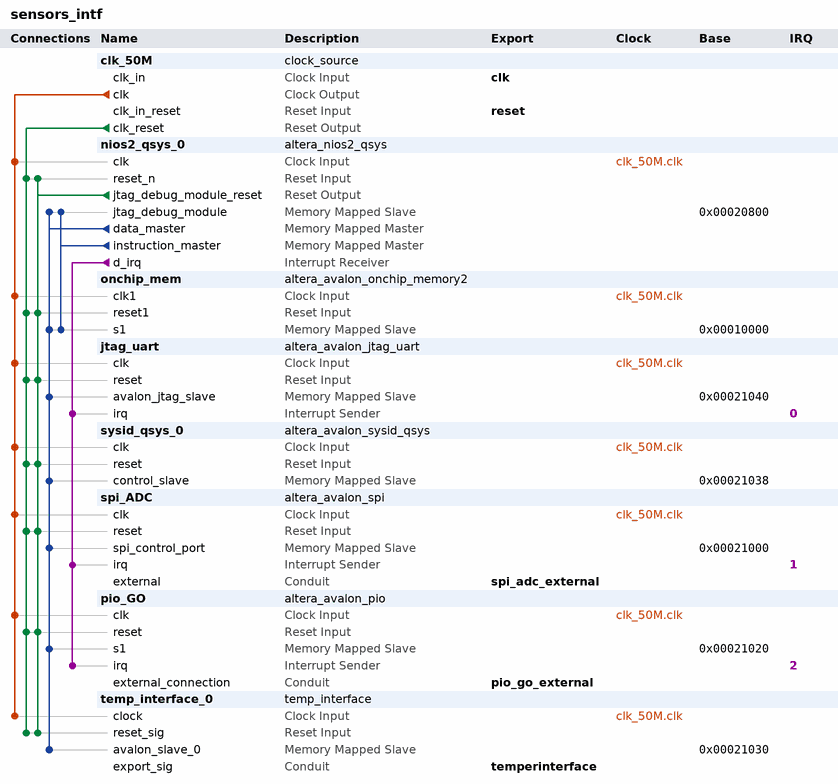
[diagram p0: system contents]
# Platform Designer (Qsys) system sensors_intf, Cyclone IV E EP4CE22F17C6
# Parameters at their usual value, and those the tool derives, are not listed.
package require -exact qsys 15.0
create_system sensors_intf
set_project_property DEVICE_FAMILY {Cyclone IV E}
set_project_property DEVICE EP4CE22F17C6

add_instance clk_50M clock_source 15.0
set_instance_parameter_value clk_50M clockFrequency 50000000

add_instance nios2_qsys_0 altera_nios2_qsys 15.0
set_instance_parameter_value nios2_qsys_0 breakSlave nios2_qsys_0.jtag_debug_module
set_instance_parameter_value nios2_qsys_0 exceptionSlave onchip_mem.s1
set_instance_parameter_value nios2_qsys_0 icache_size 8192
set_instance_parameter_value nios2_qsys_0 impl Small
set_instance_parameter_value nios2_qsys_0 mmu_TLBMissExcOffset 64
set_instance_parameter_value nios2_qsys_0 mmu_TLBMissExcSlave onchip_mem.s1
set_instance_parameter_value nios2_qsys_0 resetSlave onchip_mem.s1
set_instance_parameter_value nios2_qsys_0 resetrequest_enabled true

add_instance onchip_mem altera_avalon_onchip_memory2 15.0
set_instance_parameter_value onchip_mem dataWidth 32
set_instance_parameter_value onchip_mem dualPort false
set_instance_parameter_value onchip_mem initMemContent true
set_instance_parameter_value onchip_mem initializationFileName onchip_mem
set_instance_parameter_value onchip_mem memorySize 42000

add_instance jtag_uart altera_avalon_jtag_uart 15.0
set_instance_parameter_value jtag_uart simInteractiveOptions NO_INTERACTIVE_WINDOWS

add_instance sysid_qsys_0 altera_avalon_sysid_qsys 15.0
set_instance_parameter_value sysid_qsys_0 id 0

add_instance spi_ADC altera_avalon_spi 15.0
set_instance_parameter_value spi_ADC clockPhase 1
set_instance_parameter_value spi_ADC clockPolarity 1
set_instance_parameter_value spi_ADC dataWidth 16
set_instance_parameter_value spi_ADC masterSPI true
set_instance_parameter_value spi_ADC numberOfSlaves 1
set_instance_parameter_value spi_ADC targetClockRate 3200000

add_instance pio_GO altera_avalon_pio 15.0
set_instance_parameter_value pio_GO captureEdge true
set_instance_parameter_value pio_GO direction Input
set_instance_parameter_value pio_GO generateIRQ true
set_instance_parameter_value pio_GO irqType EDGE
set_instance_parameter_value pio_GO width 1

add_instance temp_interface_0 temp_interface 1.0

# connections
add_connection clk_50M.clk jtag_uart.clk clock
add_connection clk_50M.clk nios2_qsys_0.clk clock
add_connection clk_50M.clk onchip_mem.clk1 clock
add_connection clk_50M.clk pio_GO.clk clock
add_connection clk_50M.clk spi_ADC.clk clock
add_connection clk_50M.clk sysid_qsys_0.clk clock
add_connection clk_50M.clk temp_interface_0.clock clock
add_connection clk_50M.clk_reset jtag_uart.reset reset
add_connection clk_50M.clk_reset nios2_qsys_0.reset_n reset
add_connection clk_50M.clk_reset onchip_mem.reset1 reset
add_connection clk_50M.clk_reset pio_GO.reset reset
add_connection clk_50M.clk_reset spi_ADC.reset reset
add_connection clk_50M.clk_reset sysid_qsys_0.reset reset
add_connection clk_50M.clk_reset temp_interface_0.reset_sig reset
add_connection nios2_qsys_0.jtag_debug_module_reset jtag_uart.reset reset
add_connection nios2_qsys_0.jtag_debug_module_reset nios2_qsys_0.reset_n reset
add_connection nios2_qsys_0.jtag_debug_module_reset onchip_mem.reset1 reset
add_connection nios2_qsys_0.jtag_debug_module_reset pio_GO.reset reset
add_connection nios2_qsys_0.jtag_debug_module_reset spi_ADC.reset reset
add_connection nios2_qsys_0.jtag_debug_module_reset sysid_qsys_0.reset reset
add_connection nios2_qsys_0.jtag_debug_module_reset temp_interface_0.reset_sig reset
add_connection nios2_qsys_0.data_master jtag_uart.avalon_jtag_slave avalon
set_connection_parameter_value nios2_qsys_0.data_master/jtag_uart.avalon_jtag_slave baseAddress 0x00021040
add_connection nios2_qsys_0.data_master nios2_qsys_0.jtag_debug_module avalon
set_connection_parameter_value nios2_qsys_0.data_master/nios2_qsys_0.jtag_debug_module baseAddress 0x00020800
add_connection nios2_qsys_0.data_master onchip_mem.s1 avalon
set_connection_parameter_value nios2_qsys_0.data_master/onchip_mem.s1 baseAddress 0x00010000
add_connection nios2_qsys_0.data_master pio_GO.s1 avalon
set_connection_parameter_value nios2_qsys_0.data_master/pio_GO.s1 baseAddress 0x00021020
add_connection nios2_qsys_0.data_master spi_ADC.spi_control_port avalon
set_connection_parameter_value nios2_qsys_0.data_master/spi_ADC.spi_control_port baseAddress 0x00021000
add_connection nios2_qsys_0.data_master sysid_qsys_0.control_slave avalon
set_connection_parameter_value nios2_qsys_0.data_master/sysid_qsys_0.control_slave baseAddress 0x00021038
add_connection nios2_qsys_0.data_master temp_interface_0.avalon_slave_0 avalon
set_connection_parameter_value nios2_qsys_0.data_master/temp_interface_0.avalon_slave_0 baseAddress 0x00021030
add_connection nios2_qsys_0.instruction_master nios2_qsys_0.jtag_debug_module avalon
set_connection_parameter_value nios2_qsys_0.instruction_master/nios2_qsys_0.jtag_debug_module baseAddress 0x00020800
add_connection nios2_qsys_0.instruction_master onchip_mem.s1 avalon
set_connection_parameter_value nios2_qsys_0.instruction_master/onchip_mem.s1 baseAddress 0x00010000
add_connection nios2_qsys_0.d_irq jtag_uart.irq interrupt
set_connection_parameter_value nios2_qsys_0.d_irq/jtag_uart.irq irqNumber 0
add_connection nios2_qsys_0.d_irq pio_GO.irq interrupt
set_connection_parameter_value nios2_qsys_0.d_irq/pio_GO.irq irqNumber 2
add_connection nios2_qsys_0.d_irq spi_ADC.irq interrupt
set_connection_parameter_value nios2_qsys_0.d_irq/spi_ADC.irq irqNumber 1

# exported interfaces
add_interface clk clock sink
set_interface_property clk EXPORT_OF clk_50M.clk_in
add_interface pio_go_external conduit end
set_interface_property pio_go_external EXPORT_OF pio_GO.external_connection
add_interface reset reset sink
set_interface_property reset EXPORT_OF clk_50M.clk_in_reset
add_interface spi_adc_external conduit end
set_interface_property spi_adc_external EXPORT_OF spi_ADC.external
add_interface temperinterface conduit end
set_interface_property temperinterface EXPORT_OF temp_interface_0.export_sig

set_interconnect_requirement {$system} qsys_mm.clockCrossingAdapter HANDSHAKE
set_interconnect_requirement {$system} qsys_mm.maxAdditionalLatency 1

save_system sensors_intf.qsys
